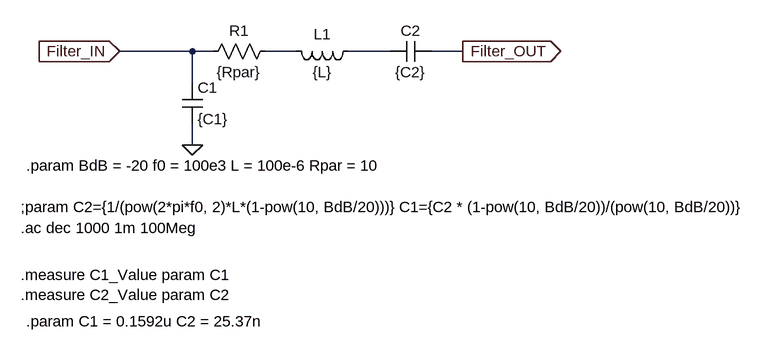
[diagram p0: schematic Filter_Model.asc]
Filter_Model.asc, the LTspice schematic file:
Version 4
SHEET 1 1212 680
WIRE 160 112 48 112
WIRE 192 112 160 112
WIRE 320 112 272 112
WIRE 464 112 400 112
WIRE 576 112 528 112
WIRE 160 160 160 112
WIRE 160 256 160 224
FLAG 160 256 0
FLAG 48 112 Filter_IN
IOPIN 48 112 In
FLAG 576 112 Filter_OUT
IOPIN 576 112 Out
SYMBOL cap 144 160 R0
SYMATTR InstName C1
SYMATTR Value {C1}
SYMBOL ind 416 96 R90
WINDOW 0 5 56 VBottom 2
WINDOW 3 32 56 VTop 2
SYMATTR InstName L1
SYMATTR Value {L}
SYMBOL cap 528 96 R90
WINDOW 0 0 32 VBottom 2
WINDOW 3 32 32 VTop 2
SYMATTR InstName C2
SYMATTR Value {C2}
SYMBOL res 288 96 R90
WINDOW 0 0 56 VBottom 2
WINDOW 3 32 56 VTop 2
SYMATTR InstName R1
SYMATTR Value {Rpar}
TEXT -104 352 Left 2 !;param C2={1/(pow(2*pi*f0, 2)*L*(1-pow(10, BdB/20)))} C1={C2 * (1-pow(10, BdB/20))/(pow(10, BdB/20))}
TEXT -104 384 Left 2 !.ac dec 1000 1m 100Meg
TEXT -96 288 Left 2 !.param BdB = -20 f0 = 100e3 L = 100e-6 Rpar = 10
TEXT -104 456 Left 2 !.measure C1_Value param C1\n.measure C2_Value param C2
TEXT -96 528 Left 2 !.param C1 = 0.1592u C2 = 25.37n

The netlist it stands for:
* Filter_Model.asc
C1 Filter_IN 0 {C1}
L1 N002 N001 {L}
C2 Filter_OUT N002 {C2}
R1 N001 Filter_IN {Rpar}
;param C2={1/(pow(2*pi*f0, 2)*L*(1-pow(10, BdB/20)))} C1={C2 * (1-pow(10, BdB/20))/(pow(10, BdB/20))}
.ac dec 1000 1m 100Meg
.param BdB = -20 f0 = 100e3 L = 100e-6 Rpar = 10
.measure C1_Value param C1
.measure C2_Value param C2
.param C1 = 0.1592u C2 = 25.37n
.backanno
.end